# Altium schematic sheet Power.SchDoc
size B
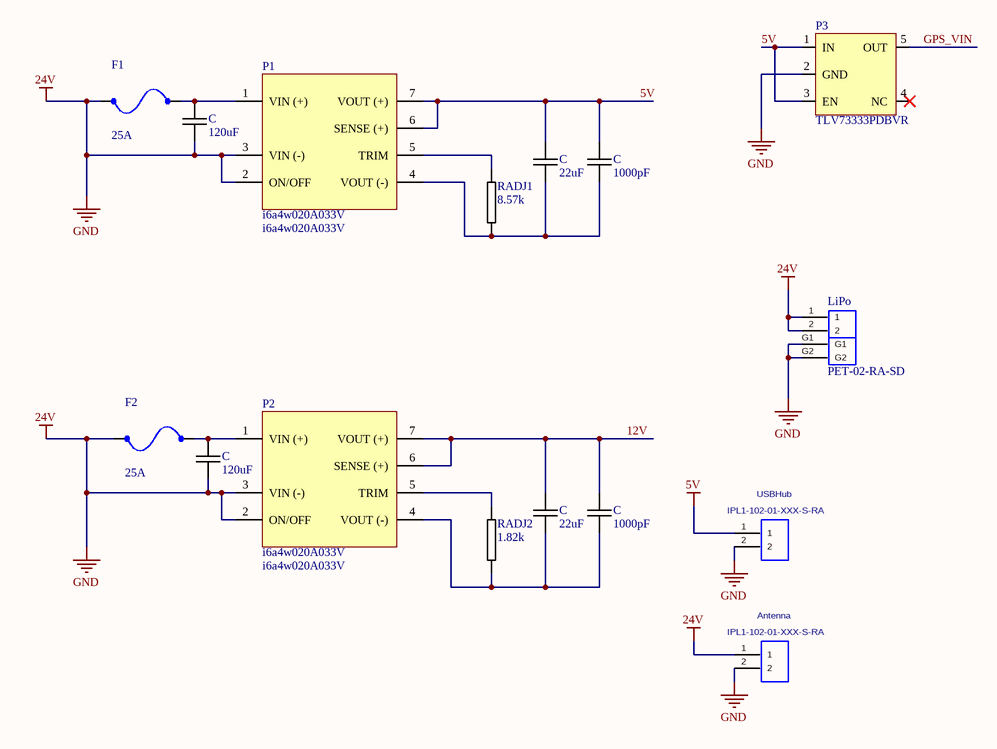
[diagram p0: Power.SchDoc]

## Parts
(Parts that share a designator on the sheet are numbered #1, #2 ... from top to bottom, then left to right.)
Antenna  IPL1-102-01-XXX-S-RA  [IPL1-102-01-XXX-S-RA]
C#1  120uF  [0805C-GENERIC]
C#2  22uF  [0805C-GENERIC]
C#3  1000pF  [0805C-GENERIC]
C#4  120uF  [0805C-GENERIC]
C#5  22uF  [0805C-GENERIC]
C#6  1000pF  [0805C-GENERIC]
F1  25A  [0501020.WR]
F2  25A  [0501020.WR]
LiPo  PET-02-RA-SD  [PET-02-01-S-RA-SD]
P1  i6a4w020A033V  [i6a4w020A033V-001-R]
P2  i6a4w020A033V  [i6a4w020A033V-001-R]
P3  TLV73333PDBVR  [TLV733P]
RADJ1  8.57k  [0805R-GENERIC]
RADJ2  1.82k  [0805R-GENERIC]
USBHub  IPL1-102-01-XXX-S-RA  [IPL1-102-01-XXX-S-RA]

## Nets
5V: C#2.1 C#3.1 P1.6(SENSE_(+)) P1.7(VOUT_(+)) P3.1(IN) P3.3(EN) USBHub.1
24V: Antenna.1 Antenna.2 C#1.2 C#4.2 F1.1 F2.1 LiPo.1 LiPo.2 LiPo.G1 LiPo.G2 P1.2(ON/OFF) P1.3(VIN_(-)) P2.2(ON/OFF) P2.3(VIN_(-)) P3.2(GND) USBHub.2  [also labelled GND]
12V: C#5.1 C#6.1 P2.6(SENSE_(+)) P2.7(VOUT_(+))
GPS_VIN: P3.5(OUT)
NetC#1_1: C#1.1 F1.2 P1.1(VIN_(+))
NetC#2_2: C#2.2 C#3.2 P1.4(VOUT_(-)) RADJ1.2
NetC#4_1: C#4.1 F2.2 P2.1(VIN_(+))
NetC#5_2: C#5.2 C#6.2 P2.4(VOUT_(-)) RADJ2.2
NetP1_5: P1.5(TRIM) RADJ1.1
NetP2_5: P2.5(TRIM) RADJ2.1

Not connected (* = marked no-connect by the designer): P3 4(NC)*

## Notes on the sheet
- Title
- Size:
- Date:
- B
- Number:
- Time:
- Revision:
- Sheet
- of
- File:

## Library data of the parts
Antenna USBHub = IPL1-102-01-XXX-S-RA: Terminal Assembly, Single Row, Right Angle, Thru-Hole, 2 Pins.; MANUFACTURER: SAMTEC; CREATED: February 14, 2016 - Wendy Xin; PCB DECAL: IPL1-102-01-XXX-S-RA
C#1-C#6 = 0805C-TBD: CAPACITOR 0805 CERAMIC VALUE TO BE DETERMINED
F1 F2 = 0501020.WR
P1 P2 = i6a4w020A033V-001-R: TDK-Lambda DC/DC Converter; Supplier 1: Digi-Key; Supplier Part Number 1: i6a4w020A033V
P3 = TLV733
RADJ1 RADJ2 = 0805R-TBD: RESISTOR 0805 VALUE TO BE DETERMINED